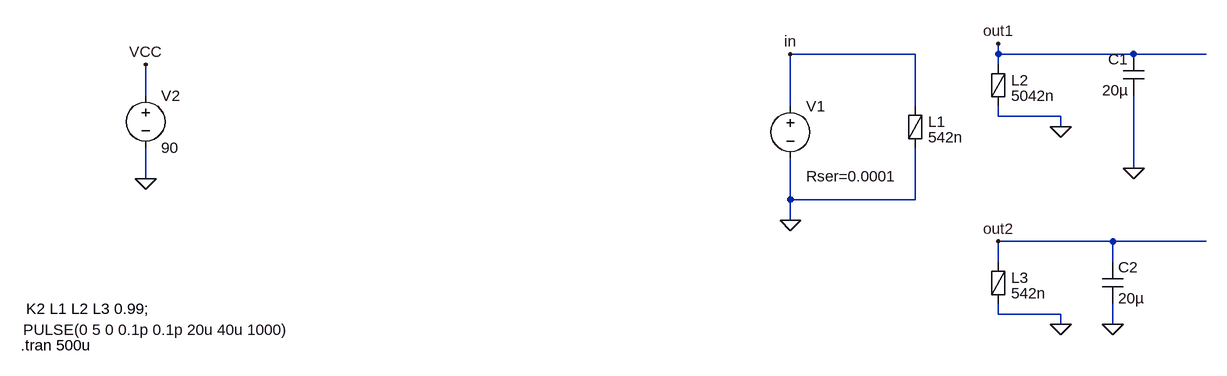
[diagram p0: schematic gdt.asc]
gdt.asc, the LTspice schematic file:
Version 4
SHEET 1 1380 680
WIRE 64 64 -128 64
WIRE 192 64 192 48
WIRE 400 64 192 64
WIRE 512 64 400 64
WIRE 192 80 192 64
WIRE -1120 128 -1120 80
WIRE -128 144 -128 64
WIRE 64 144 64 64
WIRE 192 160 192 144
WIRE 288 160 192 160
WIRE 288 176 288 160
WIRE 400 240 400 128
WIRE -1120 256 -1120 208
WIRE -128 288 -128 224
WIRE 64 288 64 208
WIRE 64 288 -128 288
WIRE -128 320 -128 288
WIRE 368 352 192 352
WIRE 512 352 368 352
WIRE 192 384 192 352
WIRE 368 384 368 352
WIRE 192 464 192 448
WIRE 288 464 192 464
WIRE 288 480 288 464
WIRE 368 480 368 448
FLAG -128 320 0
FLAG 288 176 0
FLAG 288 480 0
FLAG -128 64 in
FLAG 192 48 out1
FLAG 192 352 out2
FLAG 400 240 0
FLAG 368 480 0
FLAG -1120 256 0
FLAG -1120 80 VCC
SYMBOL voltage -128 128 R0
WINDOW 3 -1180 360 Left 2
WINDOW 123 0 0 Left 0
WINDOW 39 24 124 Left 2
SYMATTR Value PULSE(0 5 0 0.1p 0.1p 20u 40u 1000)
SYMATTR SpiceLine Rser=0.0001
SYMATTR InstName V1
SYMBOL FerriteBead 64 176 R0
SYMATTR InstName L1
SYMATTR Value 542n
SYMATTR SpiceLine Ipk=4 Rser=0.0103 Rpar=277.6 Cpar=240.8p mfg="Würth Elektronik" pn="74279224171 WE-MPSB 2220"
SYMBOL FerriteBead 192 112 R0
SYMATTR InstName L2
SYMATTR Value 5042n
SYMATTR SpiceLine Ipk=4 Rser=0.0103 Rpar=277.6 Cpar=240.8p
SYMBOL FerriteBead 192 416 R0
SYMATTR InstName L3
SYMATTR Value 542n
SYMATTR SpiceLine Ipk=4 Rser=0.0103 Rpar=277.6 Cpar=240.8p mfg="Würth Elektronik" pn="74279224171 WE-MPSB 2220"
SYMBOL cap 416 128 R180
WINDOW 0 24 56 Left 2
WINDOW 3 24 8 Left 2
SYMATTR InstName C1
SYMATTR Value 20µ
SYMBOL cap 352 384 R0
SYMATTR InstName C2
SYMATTR Value 20µ
SYMBOL voltage -1120 112 R0
WINDOW 123 0 0 Left 0
WINDOW 39 0 0 Left 0
SYMATTR InstName V2
SYMATTR Value 90
TEXT -1304 456 Left 2 !K2 L1 L2 L3 0.99;
TEXT -1312 512 Left 2 !.tran 500u

The netlist it stands for:
* gdt.asc
V1 in 0 PULSE(0 5 0 0.1p 0.1p 20u 40u 1000) Rser=0.0001
L1 in 0 542n Ipk=4 Rser=0.0103 Rpar=277.6 Cpar=240.8p mfg="Würth Elektronik" pn="74279224171 WE-MPSB 2220"
L2 out1 0 5042n Ipk=4 Rser=0.0103 Rpar=277.6 Cpar=240.8p
L3 out2 0 542n Ipk=4 Rser=0.0103 Rpar=277.6 Cpar=240.8p mfg="Würth Elektronik" pn="74279224171 WE-MPSB 2220"
C1 0 out1 20µ
C2 out2 0 20µ
V2 VCC 0 90
K2 L1 L2 L3 0.99;
.tran 500u
.backanno
.end